# Altium schematic sheet uMote-pic.SchDoc
size A4
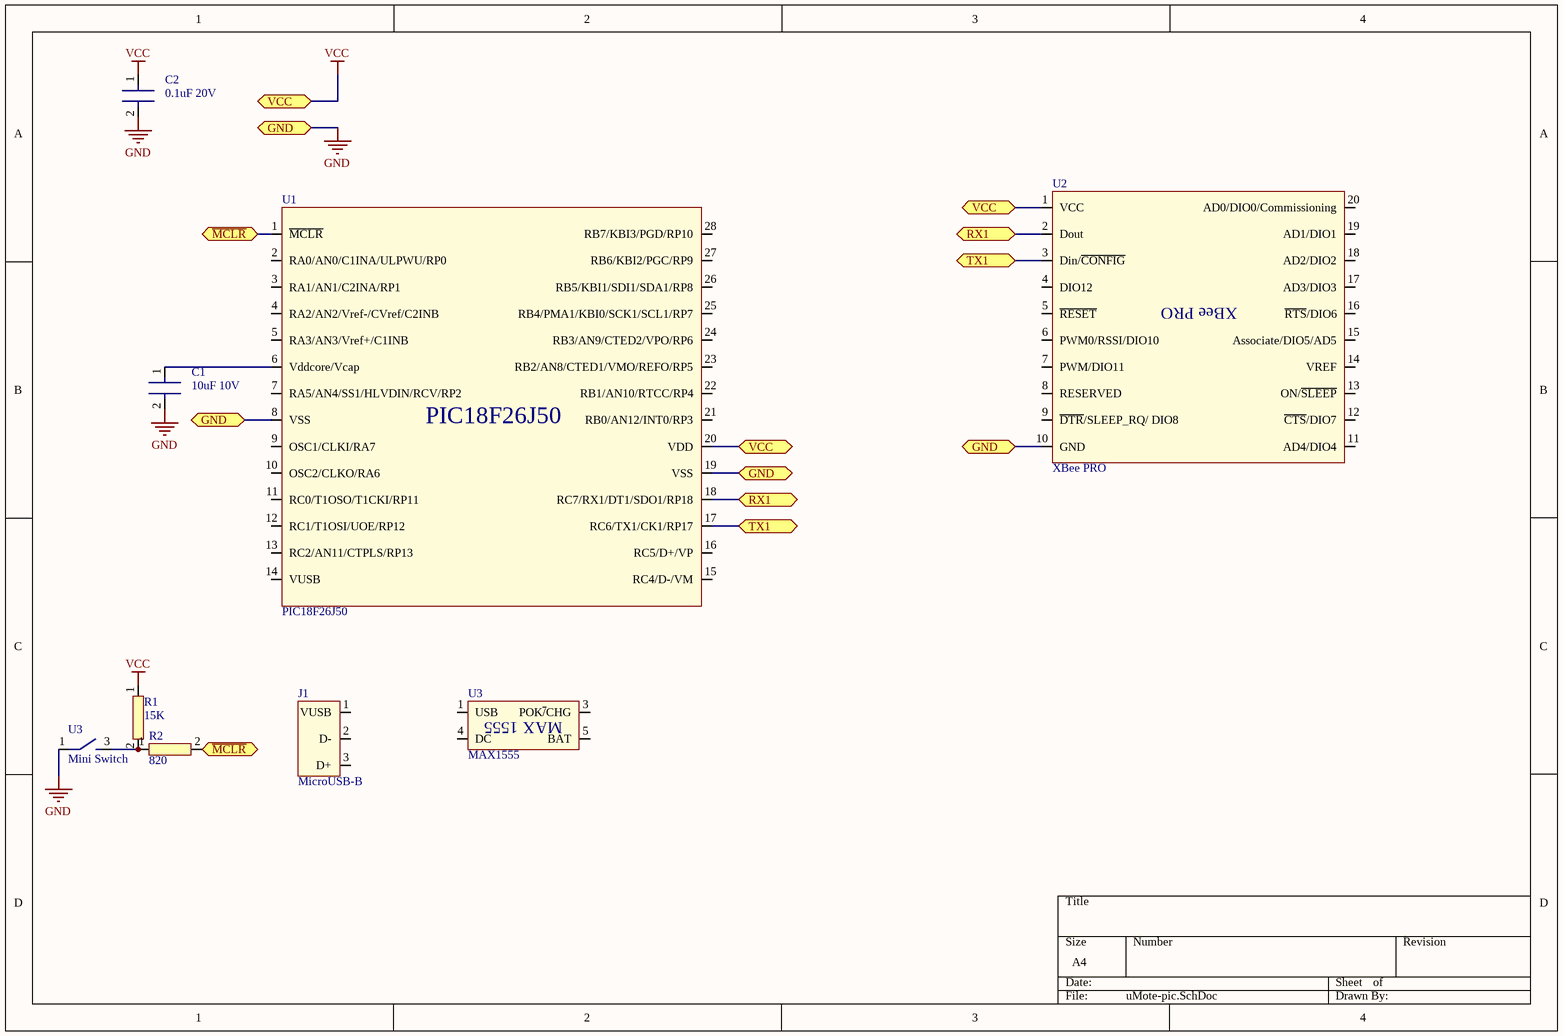
[diagram p0: uMote-pic.SchDoc]

## Parts
(Parts that share a designator on the sheet are numbered #1, #2 ... from top to bottom, then left to right.)
C1  10uF 10V  [Capacitor EIA 1206]
C2  0.1uF 20V  [Capacitor EIA 1206]
J1  MicroUSB-B
R1  15K  [EIA 1206]
R2  820  [EIA 1206]
U1  PIC18F26J50
U2  XBee PRO
U3#1  MAX1555
U3#2  Mini Switch  [Mini Switch]

## Ports
GND, RX1, TX1, VCC, VCC (bidir), ~{MCLR}

## Nets
GND: C1.2 C2.2 J1.4(GND) J1.5(SHIELD) U1.8(VSS) U1.19(VSS) U2.10(GND) U3#1.2(GND) U3#2.1 ; port GND
VCC: C2.1 R1.1 U1.20(VDD) U2.1(VCC) ; port VCC
~{MCLR}: R2.2 U1.1(~{MCLR}) ; port ~{MCLR}
RX1: U1.18(RC7/RX1/DT1/SDO1/RP18) U2.2(Dout) ; port RX1
TX1: U1.17(RC6/TX1/CK1/RP17) U2.3(Din/~{CONFIG}) ; port TX1
NetC1_1: C1.1 U1.6(Vddcore/Vcap)
NetR1_2: R1.2 R2.1 U3#2.3

Not connected (* = marked no-connect by the designer): J1 1(VUSB) 2(D-) 3(D+); U1 2(RA0/AN0/C1INA/ULPWU/RP0) 3(RA1/AN1/C2INA/RP1) 4(RA2/AN2/Vref-/CVref/C2INB) 5(RA3/AN3/Vref+/C1INB) 7(RA5/AN4/SS1/HLVDIN/RCV/RP2) 9(OSC1/CLKI/RA7) 10(OSC2/CLKO/RA6) 11(RC0/T1OSO/T1CKI/RP11) 12(RC1/T1OSI/UOE/RP12) 13(RC2/AN11/CTPLS/RP13) 14(VUSB) 15(RC4/D-/VM) 16(RC5/D+/VP) 21(RB0/AN12/INT0/RP3) 22(RB1/AN10/RTCC/RP4) 23(RB2/AN8/CTED1/VMO/REFO/RP5) 24(RB3/AN9/CTED2/VPO/RP6) 25(RB4/PMA1/KBI0/SCK1/SCL1/RP7) 26(RB5/KBI1/SDI1/SDA1/RP8) 27(RB6/KBI2/PGC/RP9) 28(RB7/KBI3/PGD/RP10); U2 4(DIO12) 5(~{RESET}) 6(PWM0/RSSI/DIO10) 7(PWM/DIO11) 8(RESERVED) 9(~{DTR}/SLEEP_RQ/_DIO8) 11(AD4/DIO4) 12(~{CTS}/DIO7) 13(ON/~{SLEEP}) 14(VREF) 15(Associate/DIO5/AD5) 16(~{RTS}/DIO6) 17(AD3/DIO3) 18(AD2/DIO2) 19(AD1/DIO1) 20(AD0/DIO0/Commissioning); U3#1 1(USB) 3(POK~{/}CHG) 4(DC) 5(BAT)

## Notes on the sheet
- (in symbol MAX1555) MAX 1555

## Library data of the parts
C1 C2 = TDK C3216X7R1C106K
R1 R2 = RES 1206